# Altium schematic sheet Output.Schematic.SchDoc
size A
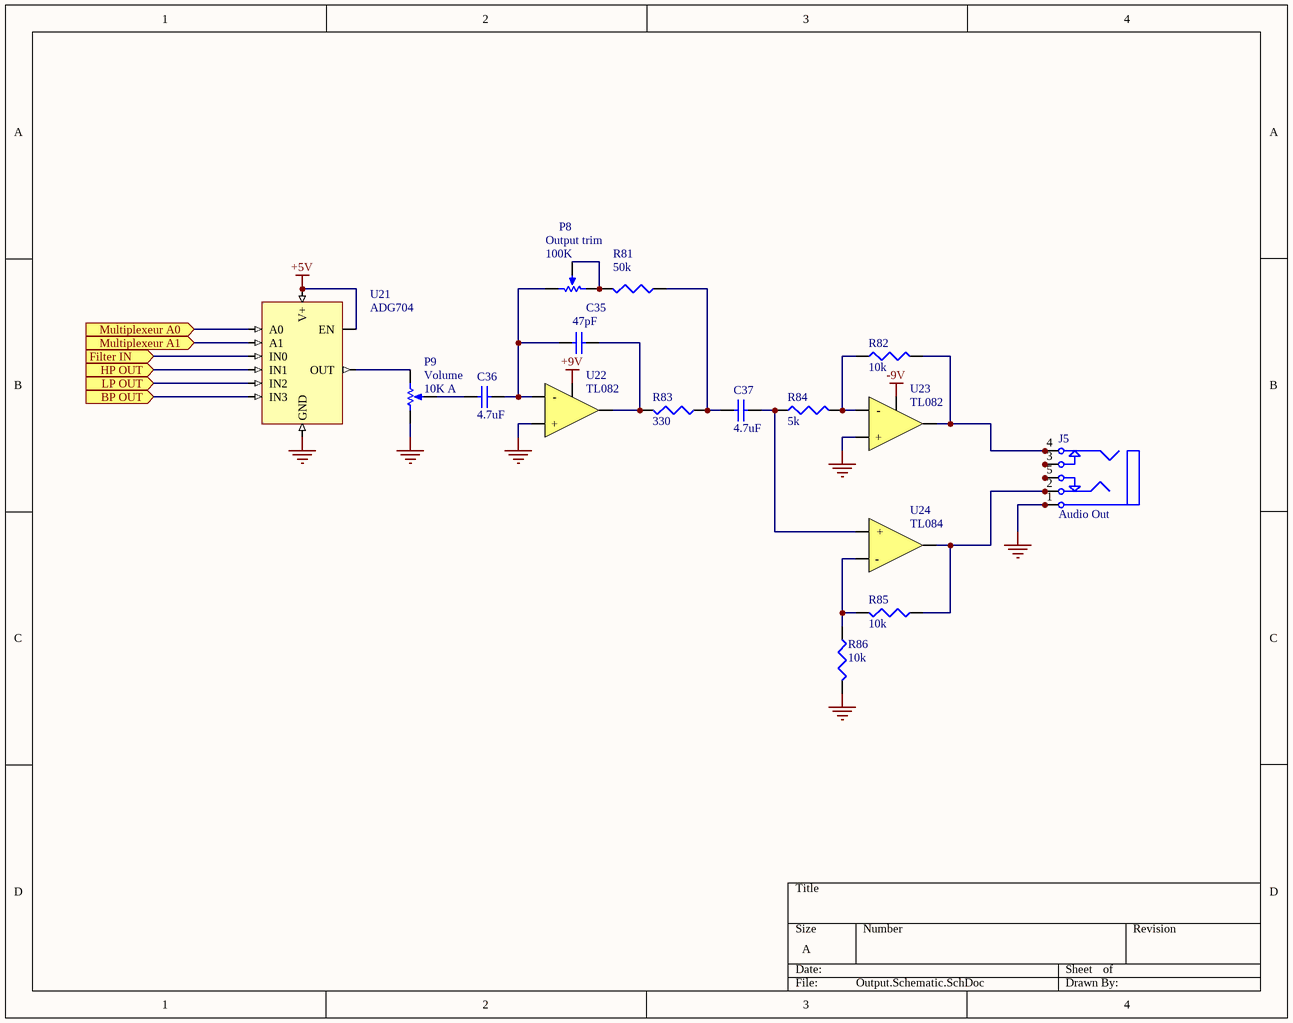
[diagram p0: Output.Schematic.SchDoc]

## Parts
C35  47pF  [CAPC1608N]
C36  4.7uF  [CAPC1608N]
C37  4.7uF  [CAPC1608N]
J5  Audio Out  [ST-3150-5N]
P8  Output trim  value 100K  [BOURNS Trim pot]
P9  Volume  value 10K A  [ALPS Potentiometer]
R81  50k  [CAPC1608N]
R82  10k  [CAPC1608N]
R83  330  [CAPC1608N]
R84  5k  [CAPC1608N]
R85  10k  [J1-0603]
R86  10k  [RESC6332]
U21  ADG704  [ADG704]
U22  TL082  [TL084_3PADS+ALIM]
U23  TL082  [TL084_3PADS+ALIM]
U24  TL084  [TL084_3PADS]

## Ports
BP OUT (in), Filter IN (in), HP OUT (in), LP OUT (in), Multiplexeur A0 (in), Multiplexeur A1 (in)

## Nets
+5V: U21.5(EN) U21.6(V+)
+9V: U22.4(VCC+)
-9V: U23.4(VCC+)
GND: J5.1 J5.1A J5.1B P9.1(TOP) R86.2 U21.3(GND) U22.3(+) U23.3(+)
BP OUT: U21.7(IN3) ; port BP OUT
Filter IN: U21.2(IN0) ; port Filter IN
HP OUT: U21.9(IN1) ; port HP OUT
LP OUT: U21.4(IN2) ; port LP OUT
Multiplexeur A0: U21.1(A0) ; port Multiplexeur A0
Multiplexeur A1: U21.10(A1) ; port Multiplexeur A1
NetC35_1: C35.1 C36.2 P8.1(TOP) U22.2(-)
NetC35_2: C35.2 R83.2 U22.1(OUT)
NetC36_1: C36.1 P9.3(TAP)
NetC37_1: C37.1 R81.1 R83.1
NetC37_2: C37.2 R84.1 U24.3(+)
NetJ5_2: J5.2 J5.2A J5.2B R85.1 U24.1(OUT)
NetJ5_3: J5.3 J5.3A J5.3B
NetJ5_4: J5.4 J5.4A J5.4B R82.2 U23.1(OUT)
NetJ5_5: J5.5 J5.5A J5.5B
NetP8_2: P8.2(BOT) P8.3(TAP) R81.2
NetP9_2: P9.2(BOT) U21.8(OUT)
NetR82_1: R82.1 R84.2 U23.2(-)
NetR85_2: R85.2 R86.1 U24.2(-)

## Library data of the parts
C35 = Cap Semi: Capacitor (Semiconductor SIM Model); Published: 8-Jun-2000; LatestRevisionDate: 29-May-2009; LatestRevisionNote: IPC-7351 Footprint Added.; PackageReference: C1206; Publisher: Altium Limited; PackageDescription: Chip Capacitor; Value: 47pF
C36 C37 = Cap Semi: Capacitor (Semiconductor SIM Model); Value: 4.7u; Published: 8-Jun-2000; LatestRevisionDate: 29-May-2009; LatestRevisionNote: IPC-7351 Footprint Added.; PackageReference: C1206; Publisher: Altium Limited; PackageDescription: Chip Capacitor
J5 = Phonejack Stereo SW: 3-Conductor Jack with 2 break contacts (normals) and 2 auxiliary make contacts; Published: 5-Jan-2004; LatestRevisionDate: 17-Dec-2003; LatestRevisionNote: PCB Footprint replaced.; DatasheetDocument: 07-Mar-2000; Publisher: Altium Limited; ComponentLink1Description: Manufacturer Link; ComponentLink1URL: http://domino.kycon.com/internet/Products.html
P8 = RPot: Potentiometer; Sim Note: Enter the Resistance value and the set point into parameter fields.; Set Position: 0.5; Fabricant: Bourns; Ref_Fabricant: 3362P-1-103LF; Published: 8-Jun-2000; LatestRevisionDate: 17-Jul-2002; LatestRevisionNote: Re-released for DXP Platform.; PackageReference: VR5; Publisher: Altium Limited; PackageDescription: Variable Resistor, Thru-Hole; 3 Leads; Datasheet: http://www.farnell.com/datasheets/2034958.pdf; Ref_Farnell: 9354301
P9 = RPot: Potentiometer; Sim Note: Enter the Resistance value and the set point into parameter fields.; Set Position: 0.5; Ref_Fabricant: RK09K1130C94; Fabricant: ALPS; Published: 8-Jun-2000; LatestRevisionDate: 17-Jul-2002; LatestRevisionNote: Re-released for DXP Platform.; PackageReference: VR5; Publisher: Altium Limited; PackageDescription: Variable Resistor, Thru-Hole; 3 Leads; Datasheet: http://www.farnell.com/datasheets/1718712.pdf; Ref_Farnell: 1191742
R81-R86 = Res3: Resistor; Published: 8-Jun-2000; LatestRevisionDate: 29-May-2009; LatestRevisionNote: IPC-7351 Footprint Added.; PackageReference: J1-0603; Publisher: Altium Limited; PackageDescription: Chip Resistor
  R81: Value: 50K
  R82 R85 R86: Value: 10K
  R83: Value: 330
  R84: Value: 5K
U21 = ADG704: Ref_Fabricant: MC100EP57DTG; Fabricant: On Semiconductor; Datasheet: http://www.farnell.com/datasheets/1915143.pdf; Ref_Farnell: 1468710
U22 U23 = TL082: Ref_Fabricant: TL082ACD; Fabricant: Fairchild Semiconductor; Ref_Farnell: 2147256; Datasheet: http://www.farnell.com/datasheets/1965618.pdf
U24 = TL084: Ref_Fabricant: TL084BCD; Fabricant: Fairshild Semiconductor; Ref_Farnell: 9593438; Datasheet: http://www.farnell.com/datasheets/1882473.pdf